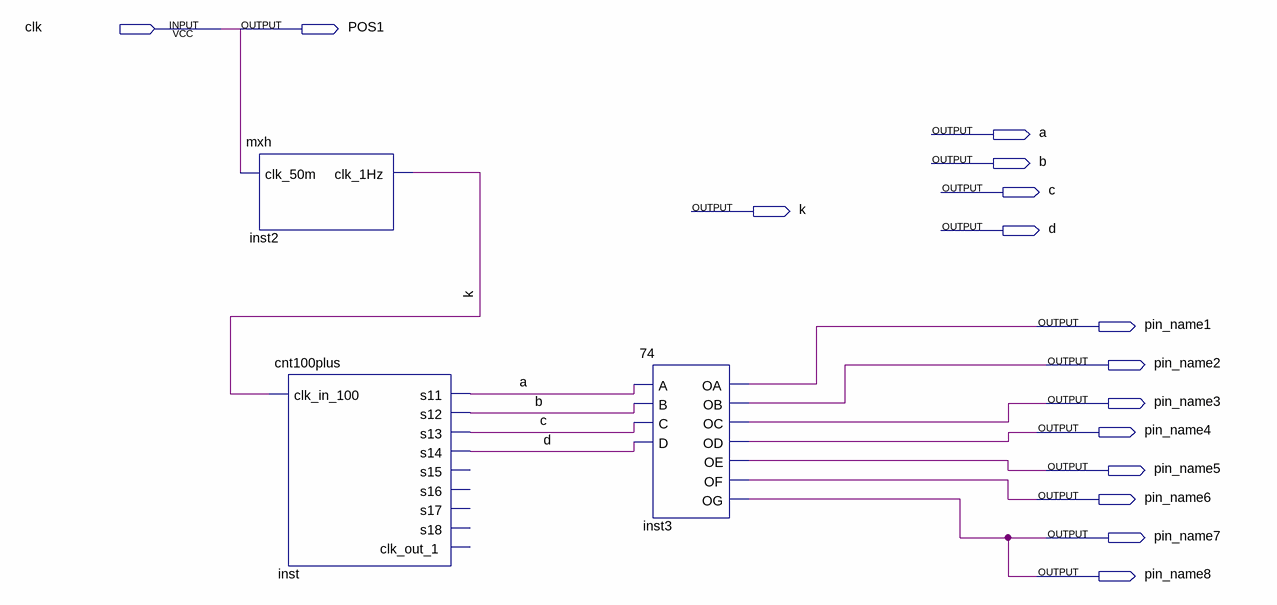
[diagram p0: schematic sheet]
// Quartus schematic CLOCK.bdf as structural Verilog: 3 symbols, 15 pins
module CLOCK (
  input  clk,
  output POS1,
  output a,
  output b,
  output c,
  output k,
  output d,
  output pin_name1,
  output pin_name2,
  output pin_name3,
  output pin_name4,
  output pin_name5,
  output pin_name6,
  output pin_name7,
  output pin_name8
);

  mxh inst2 (.clk_50m(clk), .clk_1Hz(k));
  cnt100plus inst (.clk_in_100(k), .s11(a), .s12(b), .s13(c), .s14(d));  // open: s15, s16, s17, s18, clk_out_1
  \74  inst3 (
    .A(a), .B(b), .C(c), .D(d), .OA(pin_name1), .OB(pin_name2), .OC(pin_name3), .OD(pin_name4),
    .OE(pin_name5), .OF(pin_name6), .OG(pin_name7));

  assign pin_name8 = pin_name7;
  assign POS1 = clk;
endmodule
